# EAGLE design sam4_iot (EAGLE 9.0.1)
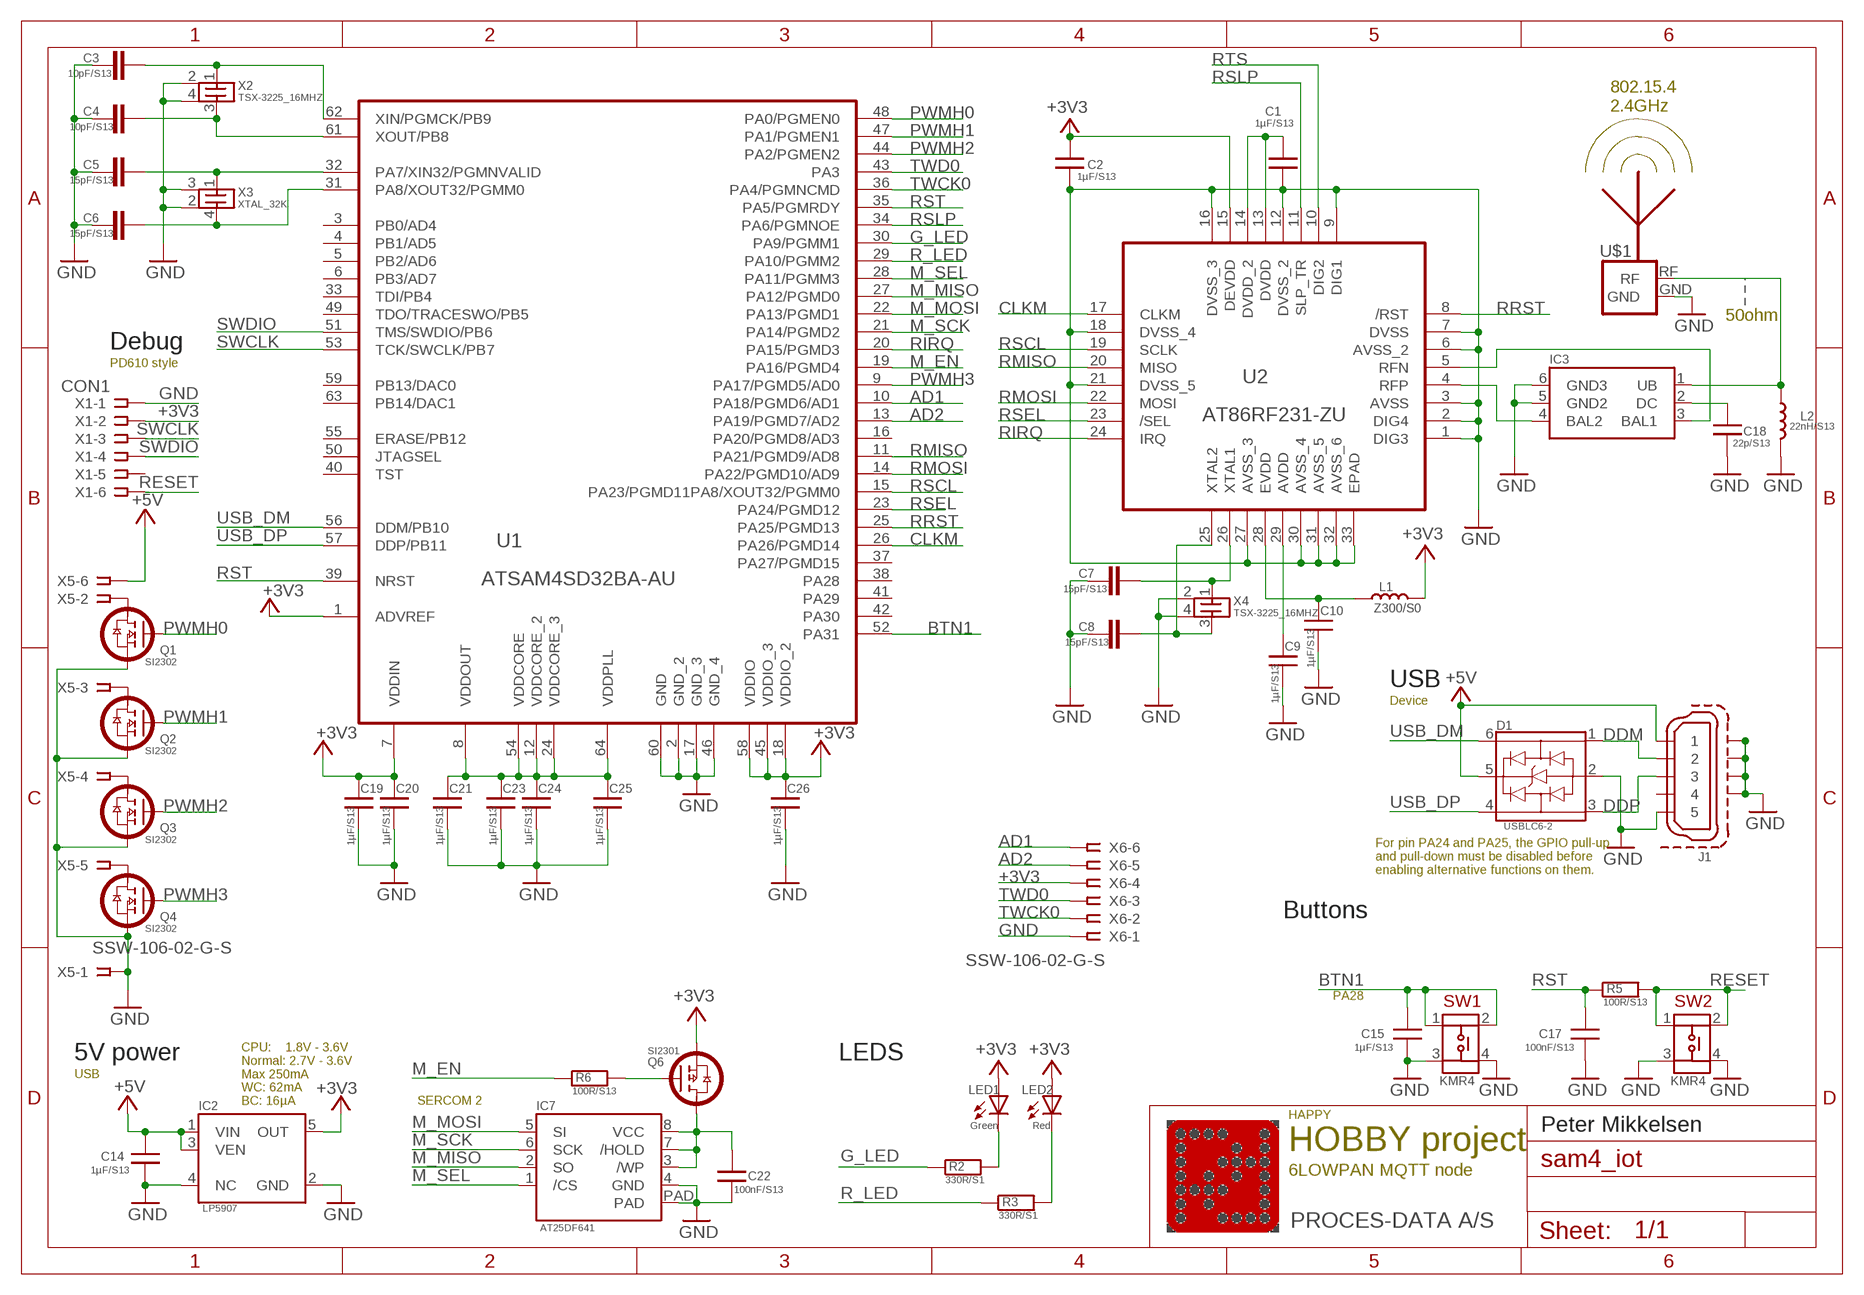
[diagram p0: schematic, sheet 1]

## Parts
C1  1µF/S13  C-EUC0603  [C0603]
C2  1µF/S13  C-EUC0603  [C0603]
C3  10pF/S13  C-EUC0603  [C0603]
C4  10pF/S13  C-EUC0603  [C0603]
C5  15pF/S13  C-EUC0603  [C0603]
C6  15pF/S13  C-EUC0603  [C0603]
C7  15pF/S13  C-EUC0603  [C0603]
C8  15pF/S13  C-EUC0603  [C0603]
C9  1µF/S13  C-EUC0603  [C0603]
C10  1µF/S13  C-EUC0603  [C0603]
C14  1µF/S13  C-EUC0603  [C0603]
C15  1µF/S13  C-EUC0603  [C0603]
C17  100nF/S13  C-EUC0603  [C0603]
C18  22p/S13  C-EUC0603  [C0603]
C19  1µF/S13  C-EUC0603  [C0603]
C20  1µF/S13  C-EUC0603  [C0603]
C21  1µF/S13  C-EUC0603  [C0603]
C22  100nF/S13  C-EUC0603  [C0603]
C23  1µF/S13  C-EUC0603  [C0603]
C24  1µF/S13  C-EUC0603  [C0603]
C25  1µF/S13  C-EUC0603  [C0603]
C26  1µF/S13  C-EUC0603  [C0603]
D1  USBLC6-2  [SOT_6]
IC2  LP5907  [SOT23-5]
IC3  BALUN  [2450BM15A0002]
IC7  AT25DF641  [VDFN_8MW1]
J1  MICROUSB  [MICROUSB]
L1  Z300/S0  L0603  [L0603]
L2  22nH/S13  L0603  [L0603]
LED1  Green  LEDMINI-TOP  [OSRAM-MINI-TOP-LED]
LED2  Red  LEDMINI-TOP  [OSRAM-MINI-TOP-LED]
Q1  SI2302  [TO-236(SOT23)]
Q2  SI2302  [TO-236(SOT23)]
Q3  SI2302  [TO-236(SOT23)]
Q4  SI2302  [TO-236(SOT23)]
Q6  SI2301  [TO-236(SOT23)]
R2  330R/S1  R-EU_R1206  [R1206]
R3  330R/S1  R-EU_R1206  [R1206]
R5  100R/S13  R-EU_R0603  [R0603]
R6  100R/S13  R-EU_R0603  [R0603]
SW1  KMR4  [KMR4]
SW2  KMR4  [KMR4]
U1  ATSAM4SD32BA-AU  [QFP50P1200X1200X160-64N]
U2  AT86RF231-ZU  [QFN50P500X500X100-32N]
U$1  ANTENNA_1RIGHT  [SWRA117D_RIGHT]
X1  CON1  SSW-103-02-S-D  [SSW-103-02-S-D]
X2  TSX-3225_16MHZ  [TSX-3225]
X3  XTAL_32K  [CM200S]
X4  TSX-3225_16MHZ  [TSX-3225]
X5  SSW-106-02-G-S  [SSW-106-02-G-S]
X6  SSW-106-02-G-S  [SSW-106-02-G-S]

## Nets
+3V3: C2.1 C19.1 C20.1 C26.1 IC2.5(OUT) L1.P$1 LED1.A LED2.A Q6.3(S) U1.1(ADVREF) U1.7(VDDIN) U1.18(VDDIO_2) U1.45(VDDIO_3) U1.58(VDDIO) U2.15(DEVDD) X1.2 X6.4
+5V: C14.1 D1.5 IC2.1(VIN) IC2.3(VEN) J1.1 X5.6
AD1: U1.10(PA18/PGMD6/AD1) X6.6
AD2: U1.13(PA19/PGMD7/AD2) X6.5
BTN1: C15.1 SW1.1 SW1.2 U1.52(PA31)
CLKM: U1.26(PA26/PGMD14) U2.17(CLKM)
DDM: D1.1 J1.2
DDP: D1.3 J1.3
G_LED: R2.1 U1.30(PA9/PGMM1)
GND: C1.2 C2.2 C3.1 C4.1 C5.1 C6.1 C7.1 C8.1 C9.2 C10.2 C14.2 C15.2 C17.2 C18.2 C19.2 C20.2 C21.2 C22.2 C23.2 C24.2 C25.2 C26.2 D1.2 IC2.2(GND) IC2.4(NC) IC3.5(GND2) IC3.6(GND3) IC7.4(GND) IC7.PAD J1.5 J1.6 J1.7 J1.8 J1.9 L2.P$1 Q1.2(S) Q2.2(S) Q3.2(S) Q4.2(S) SW1.3 SW1.4 SW2.3 SW2.4 U1.2(GND_2) U1.17(GND_3) U1.46(GND_4) U1.60(GND) U2.1(DIG3) U2.2(DIG4) U2.3(AVSS) U2.6(AVSS_2) U2.7(DVSS) U2.9(DIG1) U2.12(DVSS_2) U2.16(DVSS_3) U2.18(DVSS_4) U2.21(DVSS_5) U2.27(AVSS_3) U2.30(AVSS_4) U2.31(AVSS_5) U2.32(AVSS_6) U2.33(EPAD) U$1.GND X1.1 X2.2(GND1) X2.4(GND2) X3.2(GND2) X3.3(GND1) X4.2(GND1) X4.4(GND2) X5.1 X6.1
M_EN: R6.1 U1.19(PA16/PGMD4)
M_MISO: IC7.2(SO) U1.27(PA12/PGMD0)
M_MOSI: IC7.5(SI) U1.22(PA13/PGMD1)
M_SCK: IC7.6(SCK) U1.21(PA14/PGMD2)
M_SEL: IC7.1(/CS) U1.28(PA11/PGMM3)
N$1: IC3.3(BAL1) U2.5(RFN)
N$2: C9.1 U2.29(AVDD)
N$3: C21.1 C23.1 C24.1 C25.1 U1.8(VDDOUT) U1.12(VDDCORE_2) U1.24(VDDCORE_3) U1.54(VDDCORE) U1.64(VDDPLL)
N$4: C1.1 U2.13(DVDD) U2.14(DVDD_2)
N$5: C10.1 L1.P$2 U2.28(EVDD)
N$6: Q1.3(D) X5.2
N$7: Q2.3(D) X5.3
N$8: Q3.3(D) X5.4
N$9: Q4.3(D) X5.5
N$12: LED2.C R3.2
N$13: LED1.C R2.2
N$28: Q6.1(G) R6.2
PWMH0: Q1.1(G) U1.48(PA0/PGMEN0)
PWMH1: Q2.1(G) U1.47(PA1/PGMEN1)
PWMH2: Q3.1(G) U1.44(PA2/PGMEN2)
PWMH3: Q4.1(G) U1.9(PA17/PGMD5/AD0)
R_LED: R3.1 U1.29(PA10/PGMM2)
RESET: R5.2 SW2.1 SW2.2 X1.6
RF: IC3.1(UB) L2.P$2 U$1.RF
RF_DC: C18.1 IC3.2(DC)
RFP: IC3.4(BAL2) U2.4(RFP)
RIRQ: U1.20(PA15/PGMD3) U2.24(IRQ)
RMISO: U1.11(PA21/PGMD9/AD8) U2.20(MISO)
RMOSI: U1.14(PA22/PGMD10/AD9) U2.22(MOSI)
RRST: U1.25(PA25/PGMD13) U2.8(/RST)
RSCL: U1.15(PA23/PGMD11PA8/XOUT32/PGMM0) U2.19(SCLK)
RSEL: U1.23(PA24/PGMD12) U2.23(/SEL)
RSLP: U1.34(PA6/PGMNOE) U2.11(SLP_TR)
RST: C17.1 R5.1 U1.35(PA5/PGMRDY) U1.39(NRST)
RTS: U2.10(DIG2)
SWCLK: U1.53(TCK/SWCLK/PB7) X1.3
SWDIO: U1.51(TMS/SWDIO/PB6) X1.4
TWCK0: U1.36(PA4/PGMNCMD) X6.2
TWD0: U1.43(PA3) X6.3
USB_DM: D1.6 U1.56(DDM/PB10)
USB_DP: D1.4 U1.57(DDP/PB11)
VCCF: C22.1 IC7.3(/WP) IC7.7(/HOLD) IC7.8(VCC) Q6.2(D)
XTAL1: C4.2 U1.61(XOUT/PB8) X2.3(X2)
XTAL2: C3.2 U1.62(XIN/PGMCK/PB9) X2.1(X1)
XTAL3: C7.2 U2.26(XTAL1) X4.1(X1)
XTAL4: C8.2 U2.25(XTAL2) X4.3(X2)
XTAL32KHZ1: C6.2 U1.31(PA8/XOUT32/PGMM0) X3.4(X2)
XTAL32KHZ2: C5.2 U1.32(PA7/XIN32/PGMNVALID) X3.1(X1)
Unconnected: J1.4 U1.3(PB0/AD4) U1.4(PB1/AD5) U1.5(PB2/AD6) U1.6(PB3/AD7) U1.16(PA20/PGMD8/AD3) U1.33(TDI/PB4) U1.37(PA27/PGMD15) U1.38(PA28) U1.40(TST) U1.41(PA29) U1.42(PA30) U1.49(TDO/TRACESWO/PB5) U1.50(JTAGSEL) U1.55(ERASE/PB12) U1.59(PB13/DAC0) U1.63(PB14/DAC1) X1.5

## Notes on the sheet
- 802.15.4 
  2.4GHz
- 50ohm
- Debug
- PD610 style
- USB
- Device
- For pin PA24 and PA25, the GPIO pull-up
  and pull-down must be disabled before
  enabling alternative functions on them.
- Buttons
- PA28
- 5V power | LEDS
- USB
- CPU:    1.8V - 3.6V
  Normal: 2.7V - 3.6V
  Max 250mA
  WC: 62mA
  BC: 16µA
- SERCOM 2
- HAPPY
- Peter Mikkelsen
- HOBBY project
- 6LOWPAN MQTT node
- PROCES-DATA A/S

## Library data of the parts
C1 C2 C9 C10 C14 C15 C17-C26 = IOT4:C-EU: CAPACITOR, European symbol
C3-C8 = rcl:C-EU: CAPACITOR, European symbol; SPICEPREFIX: C
D1 = IOT4:USBLC6-2
IC2 = IOT4:LP5907
IC3 = IOT4:BALUN
IC7 = IOT4:AT25DF641
J1 = IOT4:MICROUSB
L1 L2 = IOT4:L0603
LED1 LED2 = led:LED: LED OSRAM: - CHIPLED LG R971, LG N971, LY N971, LG Q971, LY Q971, LO R971, LY R971 LH N974, LH R974 LS Q976, LO Q976, LY Q976 LO Q996 - Hyper CHIPLED LW Q18S LB Q993, LB Q99A, LB R99A - SideLED LS A670, LO A670, LY A670, LG A670, LP A670 LB A673, LV A673, LT A673, LW A673 LH A674 LY A675 LS A676, LA A676, LO A676, LY A676, LW A676 LS A679, LY A679, LG A679 - Hyper Micro SIDELED® LS Y876, LA Y876, LO Y876, LY Y876 LT Y87S - SmartLED LW L88C, LW L88S LB L89C, LB L89S, LG L890 LS L89K, LO L89K, LY L89K LS L896, LA L896, LO L896, LY L896 - TOPLED LS T670, LO T670, LY T670, LG T670, LP T670 LSG T670, LSP T670, LSY T670, LOP T670, LYG T670 LG T671, LOG T671, LSG T671 LB T673, LV T673, LT T673, LW T673 LH T674 LS T676, LA T676, LO T676, LY T676, LB T676, LH T676, LSB T676, LW T676 LB T67C, LV T67C, LT T67C, LS T67K, LO T67K, LY T67K, LW E67C LS E67B, LA E67B, LO E67B, LY E67B, LB E67C, LV E67C, LT E67C LW T67C LS T679, LY T679, LG T679 LS T770, LO T770, LY T770, LG T770, LP T770 LB T773, LV T773, LT T773, LW T773 LH T774 LS E675, LA E675, LY E675, LS T675 LS T776, LA T776, LO T776, LY T776, LB T776 LHGB T686 LT T68C, LB T68C - Hyper Mini TOPLED® LB M676 - Mini TOPLED Santana® LG M470 LS M47K, LO M47K, LY M47K Source: http://www.osram.convergy.de LUXEON: - LUMILED® LXK2-PW12-R00, LXK2-PW12-S00, LXK2-PW14-U00, LXK2-PW14-V00 LXK2-PM12-R00, LXK2-PM12-S00, LXK2-PM14-U00 LXK2-PE12-Q00, LXK2-PE12-R00, LXK2-PE12-S00, LXK2-PE14-T00, LXK2-PE14-U00 LXK2-PB12-K00, LXK2-PB12-L00, LXK2-PB12-M00, LXK2-PB14-N00, LXK2-PB14-P00, LXK2-PB14-Q00 LXK2-PR12-L00, LXK2-PR12-M00, LXK2-PR14-Q00, LXK2-PR14-R00 LXK2-PD12-Q00, LXK2-PD12-R00, LXK2-PD12-S00 LXK2-PH12-R00, LXK2-PH12-S00 LXK2-PL12-P00, LXK2-PL12-Q00, LXK2-PL12-R00 Source: www.luxeon.com KINGBRIGHT: KA-3528ASYC Source: www.kingbright.com
Q1-Q4 = IOT4:SI2302
Q6 = IOT4:SI2301
R2 R3 R5 R6 = IOT4:R-EU_: RESISTOR, European symbol
SW1 SW2 = IOT4:KMR4
U1 = Atmel_By_element14_Batch_1-00_pm:ATSAM4SD32BA-AU: Flash MCU; DESCRIPTION: Flash MCU; MPN: ATSAM3S4BA-AU; OC_FARNELL: 1841656; OC_NEWARK: 12T1314; PACKAGE: QFP-64; SUPPLIER: Atmel
U2 = Atmel_By_element14_Batch_1-00_pm:AT86RF231-ZU: Low Power 2.4 GHz Transceiver for ZigBee,QFN-32; MPN: AT86RF231-ZU; OC_FARNELL: 1748493; OC_NEWARK: 68T4736; PACKAGE: QFN-32; SUPPLIER: ATMEL
U$1 = ant-planar-1:ANTENNA_1
X1 = con-samtec:SSW-103-02-S-D: THROUGH-HOLE .025" SQ POST SOCKET Source: Samtec SSW.pdf; MPN: SSW-103-02-S-D; OC_FARNELL: unknown; OC_NEWARK: 11P9365
X2 X4 = IOT4:TSX-3225_16MHZ
X3 = IOT4:XTAL_32K
X5 X6 = con-samtec:SSW-106-02-G-S: THROUGH-HOLE .025" SQ POST SOCKET Source: Samtec SSW.pdf; MF: Samtec Inc.; MPN: SSW-106-02-G-S; OC_FARNELL: unknown; OC_NEWARK: 11P9416

## Board
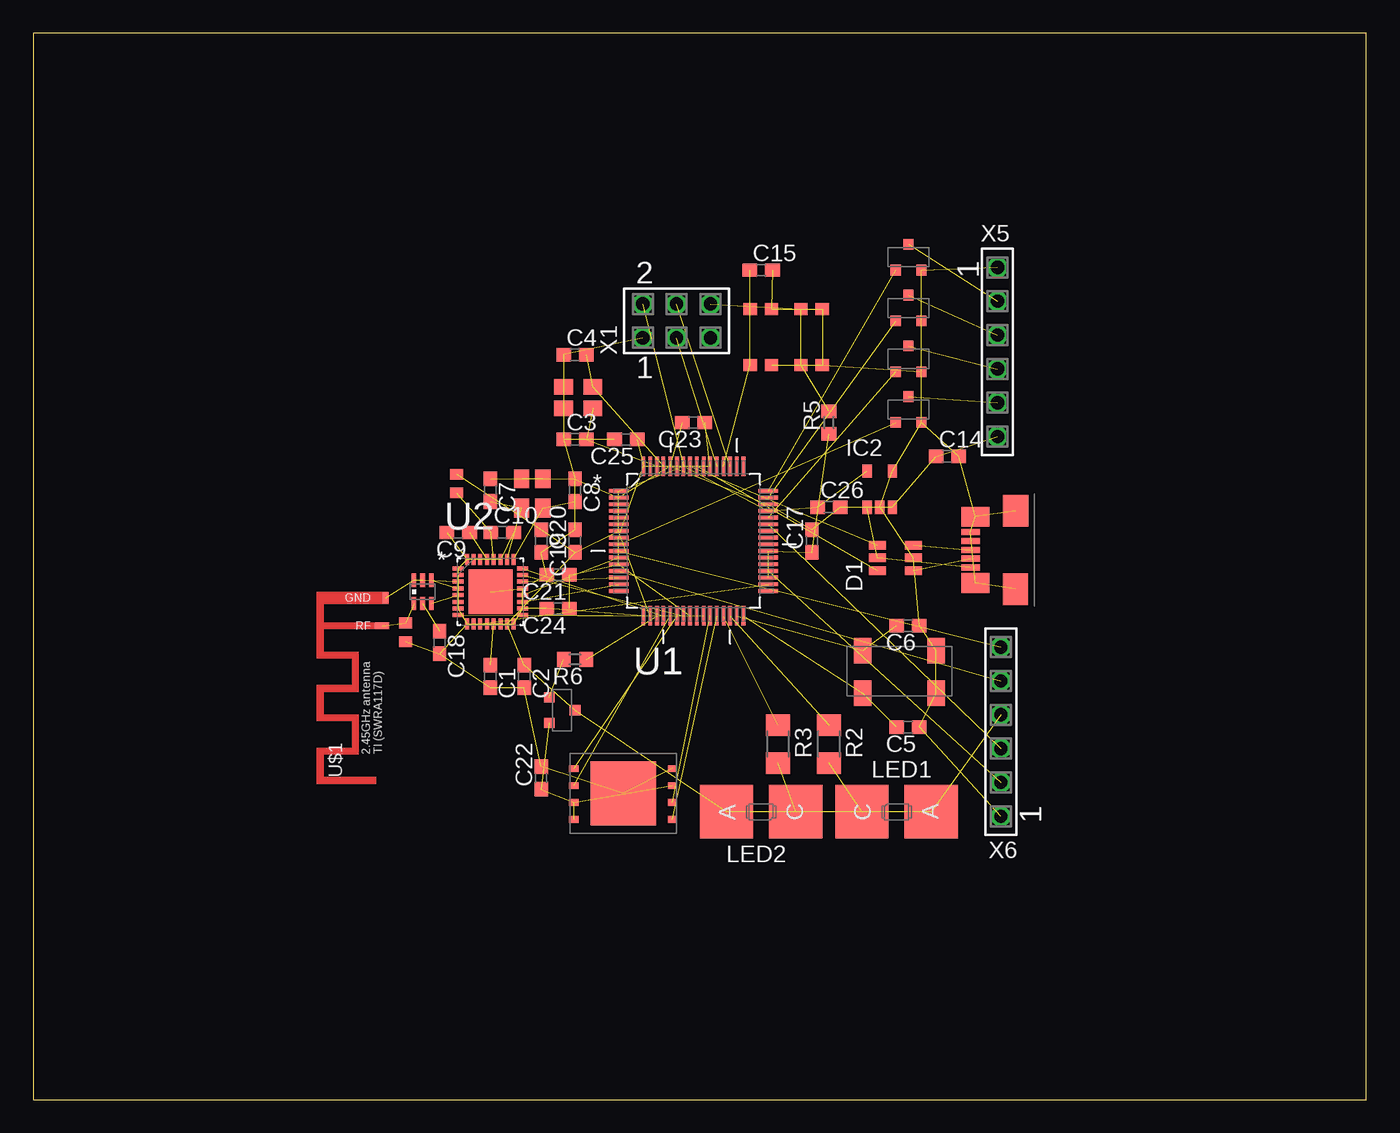
[diagram p1: board, top side]

Size 100 x 80 mm. Coordinates in mm from the lower left corner, seen from the top.
Outline: 0,0 100,0 100,80 0,80 0,0
Copper layers (1*16): Top 0.035mm / dielectric 1.5mm / Bottom 0.035mm
Design rules "default": minimum track width 6mil, minimum drill 0.35mm, track to track 6mil, track to pad 6mil, pad to pad 6mil, via to via 6mil, smd to smd 6mil, copper to edge 40mil, drill to drill 6mil, minimum pad ring 10mil, minimum via ring 8mil, stop-mask expansion 4mil, vias tented up to drill 0mil, thermal gap 10mil

### Footprints (pad centres in the part's own frame; a part is rotated, then mirrored left to right if it is on the bottom)
C0603 = smd 1.1 x 1: 1 -0.85,0; 2 0.85,0
SOT_6 = smd 0.635 x 1.27: 1 -0.95,0; 2 0,0; 3 0.95,0; 4 0.95,2.7; 5 0,2.7; 6 -0.95,2.7
SOT23-5 = smd 0.7 x 1: 1 -0.95,0; 2 0,0; 3 0.95,0; 4 0.95,2.7; 5 -0.95,2.7
2450BM15A0002 = smd 0.35 x 1: 1 -0.65,-0.875; 2 0,-0.875; 3 0.65,-0.875; 4 0.65,0.875; 5 0,0.875; 6 -0.65,0.875
VDFN_8MW1 = smd 0.7 x 0.5: 1 -3.5,1.84; 2 -3.5,0.57; 3 -3.5,-0.7; 4 -3.5,-1.97; 5 3.9,-1.97; 6 3.9,-0.7; 7 3.9,0.57; 8 3.9,1.84 | smd 4.9 x 4.8: PAD 0.2,-0.1
MICROUSB = smd 1.38 x 0.45: 1 0.8,0.71; 2 0.8,0.05; 3 0.8,-0.61; 4 0.8,-1.27; 5 0.8,-1.93 | smd 2.1 x 1.47: 6 0.44,1.88; 7 0.44,-3.1 | smd 1.9 x 2.375: 8 -2.56,2.34; 9 -2.57,-3.53
L0603 = smd 0.8 x 0.965: P$1 -1.2,0; P$2 0.2,0
OSRAM-MINI-TOP-LED = smd 4 x 4: A 0,2.6; C 0,-2.6
TO-236(SOT23) = smd 0.764 x 0.8: 1 0.96,1.94; 2 -0.96,1.94; 3 0,0
R1206 = smd 1.6 x 1.803: 1 -1.422,0; 2 1.422,0
R0603 = smd 1 x 1.1: 1 -0.85,0; 2 0.85,0
KMR4 = smd 0.9 x 1: 1 0.5,2.1; 2 4.7,2.1; 3 0.5,0.5; 4 4.7,0.5
QFP50P1200X1200X160-64N = smd 1.473 x 0.279: 1 -5.613,3.759; 2 -5.613,3.251; 3 -5.613,2.743; 4 -5.613,2.261; 5 -5.613,1.753; 6 -5.613,1.245; 7 -5.613,0.762; 8 -5.613,0.254; 9 -5.613,-0.254; 10 -5.613,-0.762; 11 -5.613,-1.245; 12 -5.613,-1.753; 13 -5.613,-2.261; 14 -5.613,-2.743; 15 -5.613,-3.251; 16 -5.613,-3.759; 33 5.613,-3.759; 34 5.613,-3.251; 35 5.613,-2.743; 36 5.613,-2.261; 37 5.613,-1.753; 38 5.613,-1.245; 39 5.613,-0.762; 40 5.613,-0.254; 41 5.613,0.254; 42 5.613,0.762; 43 5.613,1.245; 44 5.613,1.753; 45 5.613,2.261; 46 5.613,2.743; 47 5.613,3.251; 48 5.613,3.759 | smd 0.279 x 1.473: 17 -3.759,-5.613; 18 -3.251,-5.613; 19 -2.743,-5.613; 20 -2.261,-5.613; 21 -1.753,-5.613; 22 -1.245,-5.613; 23 -0.762,-5.613; 24 -0.254,-5.613; 25 0.254,-5.613; 26 0.762,-5.613; 27 1.245,-5.613; 28 1.753,-5.613; 29 2.261,-5.613; 30 2.743,-5.613; 31 3.251,-5.613; 32 3.759,-5.613; 49 3.759,5.613; 50 3.251,5.613; 51 2.743,5.613; 52 2.261,5.613; 53 1.753,5.613; 54 1.245,5.613; 55 0.762,5.613; 56 0.254,5.613; 57 -0.254,5.613; 58 -0.762,5.613; 59 -1.245,5.613; 60 -1.753,5.613; 61 -2.261,5.613; 62 -2.743,5.613; 63 -3.251,5.613; 64 -3.759,5.613
QFN50P500X500X100-32N = smd 0.813 x 0.305: 1 -2.413,1.753; 2 -2.413,1.245; 3 -2.413,0.762; 4 -2.413,0.254; 5 -2.413,-0.254; 6 -2.413,-0.762; 7 -2.413,-1.245; 8 -2.413,-1.753; 17 2.413,-1.753; 18 2.413,-1.245; 19 2.413,-0.762; 20 2.413,-0.254; 21 2.413,0.254; 22 2.413,0.762; 23 2.413,1.245; 24 2.413,1.753 | smd 0.305 x 0.813: 9 -1.753,-2.413; 10 -1.245,-2.413; 11 -0.762,-2.413; 12 -0.254,-2.413; 13 0.254,-2.413; 14 0.762,-2.413; 15 1.245,-2.413; 16 1.753,-2.413; 25 1.753,2.413; 26 1.245,2.413; 27 0.762,2.413; 28 0.254,2.413; 29 -0.254,2.413; 30 -0.762,2.413; 31 -1.245,2.413; 32 -1.753,2.413 | smd 3.302 x 3.302: 33 0,0
SWRA117D_RIGHT = smd 0.813 x 0.406: GND -0.45,0.25 | smd 0.508 x 1.016: RF -2.55,0.5
SSW-103-02-S-D = drill 1 pad 1.5 octagon: 1 -2.54,-1.27; 2 -2.54,1.27; 3 0,-1.27; 4 0,1.27; 5 2.54,-1.27; 6 2.54,1.27
TSX-3225 = smd 1.4 x 1.15: 1 1.2,0.2; 2 3.4,0.2; 3 1.2,-1.4; 4 3.4,-1.4
CM200S = smd 1.3 x 1.9: 1 0,0; 2 5.5,0; 3 5.5,3.2; 4 0,3.2
SSW-106-02-G-S = drill 1 pad 1.5 octagon: 1 -6.35,0; 2 -3.81,0; 3 -1.27,0; 4 1.27,0; 5 3.81,0; 6 6.35,0

### Placement (x,y rotation side)
C1  34.29,31.75 270 top
C2  36.83,31.75 270 top
C3  40.64,49.53 0 top
C4  40.64,55.88 0 top
C5  65.62,27.94 180 top
C6  65.62,35.56 180 top
C7  34.29,45.72 270 top
C8  40.64,45.72 270 top
C9  31.88,42.55 180 top
C10  35.18,42.55 0 top
C14  68.58,48.26 0 top
C15  54.61,62.23 0 top
C17  58.42,41.91 90 top
C18  30.48,34.29 270 top
C19  38.1,41.91 270 top
C20  40.64,41.91 90 top
C21  39.37,39.37 180 top
C22  38.1,24.13 90 top
C23  49.53,50.8 180 top
C24  39.37,36.83 180 top
C25  44.45,49.53 180 top
C26  59.69,44.45 0 top
D1  66.04,40.64 90 top
IC2  63.5,44.45 0 top
IC3  29.21,38.1 0 top
IC7  44.45,22.86 180 top
J1  71.12,40.64 180 top
L1  31.75,45.72 270 top
L2  27.94,35.56 90 top
LED1  64.77,21.59 270 top
LED2  54.61,21.59 90 top
Q1  65.66,64.17 180 top
Q2  65.66,60.36 180 top
Q3  65.66,56.55 180 top
Q4  65.66,52.74 180 top
Q6  40.64,29.21 90 top
R2  59.69,26.67 270 top
R3  55.88,26.67 270 top
R5  59.69,50.8 90 top
R6  40.64,33.02 180 top
SW1  55.88,54.61 90 top
SW2  59.69,54.61 90 top
U1  49.53,41.91 0 top
U2  34.29,38.1 0 top
U$1  26.67,38.1 90 top
X1  48.26,58.42 0 top
X2  43.18,52.07 180 top
X3  62.23,30.48 0 top
X4  36.83,43.18 90 top
X5  72.34,56.09 270 top
X6  72.6,27.6 90 top

### Tracks (layer width: path | path; a pad name or v marks a point on that pad's centre or on a via)
+3V3  (16 unrouted)
+5V  (5 unrouted)
AD1  (1 unrouted)
AD2  (1 unrouted)
BTN1  (3 unrouted)
CLKM  (1 unrouted)
DDM  (1 unrouted)
DDP  (1 unrouted)
G_LED  (1 unrouted)
GND  (71 unrouted)
M_EN  (1 unrouted)
M_MISO  (1 unrouted)
M_MOSI  (1 unrouted)
M_SCK  (1 unrouted)
M_SEL  (1 unrouted)
N$1  (1 unrouted)
N$2  (1 unrouted)
N$3  (8 unrouted)
N$4  (2 unrouted)
N$5  (2 unrouted)
N$6  (1 unrouted)
N$7  (1 unrouted)
N$8  (1 unrouted)
N$9  (1 unrouted)
N$12  (1 unrouted)
N$13  (1 unrouted)
N$14
  Top 0.152: 66.6,51 66.6,50.8
N$28  (1 unrouted)
PWMH0  (1 unrouted)
PWMH1  (1 unrouted)
PWMH2  (1 unrouted)
PWMH3  (1 unrouted)
R_LED  (1 unrouted)
RESET  (3 unrouted)
RF  (2 unrouted)
RF_DC  (1 unrouted)
RFP  (1 unrouted)
RIRQ  (1 unrouted)
RMISO  (1 unrouted)
RMOSI  (1 unrouted)
RRST  (1 unrouted)
RSCL  (1 unrouted)
RSEL  (1 unrouted)
RSLP  (1 unrouted)
RST  (3 unrouted)
SWCLK  (1 unrouted)
SWDIO  (1 unrouted)
TWCK0  (1 unrouted)
TWD0  (1 unrouted)
USB_DM  (1 unrouted)
USB_DP  (1 unrouted)
VCCF  (4 unrouted)
XTAL1  (2 unrouted)
XTAL2  (2 unrouted)
XTAL3  (2 unrouted)
XTAL4  (2 unrouted)
XTAL32KHZ1  (2 unrouted)
XTAL32KHZ2  (2 unrouted)